# Altium schematic sheet CAN and Sensors.SchDoc
size A
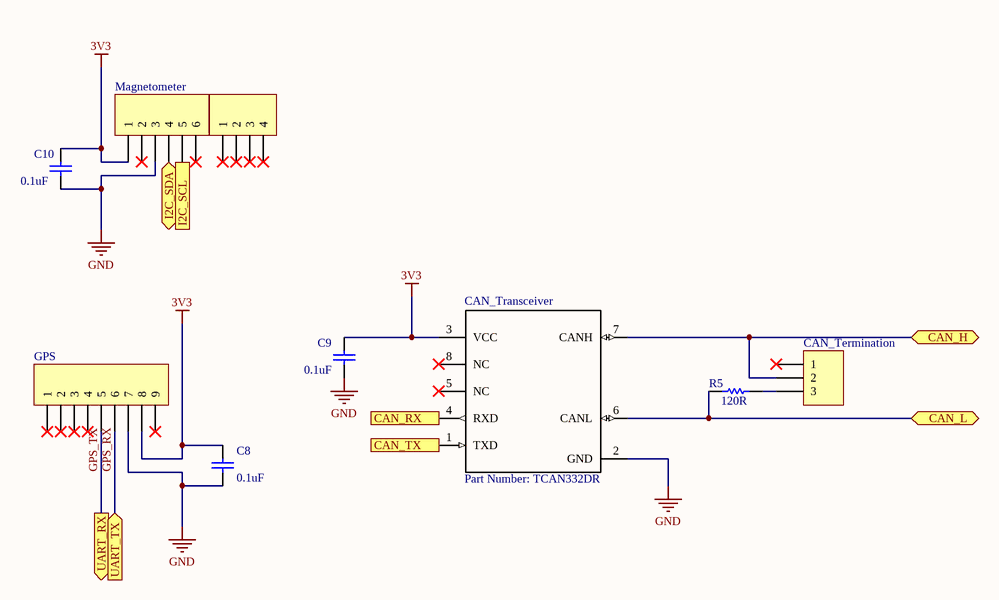
[diagram p0: CAN and Sensors.SchDoc]

## Parts
?  (no value)  [HDR1X4]
C8  0.1uF  [CAPC0805(2012)100_M]
C9  0.1uF  [CAPC0805(2012)100_M]
C10  0.1uF  [CAPC0805(2012)100_M]
CAN_Termination  (no value)  [HDR1X3]
CAN_Transceiver  Part Number: TCAN332DR  [D0008A_N]
GPS  (no value)  [HDR1X9]
Magnetometer  (no value)  [HDR1X6]
R5  120R  [RESC0805(2012)_N]

## Ports
CAN_H (bidir), CAN_L (bidir), CAN_RX (out), CAN_TX (in), I2C_SCL (in), I2C_SDA (bidir), UART_RX (out), UART_TX (in)

## Nets
3V3: C8.2 C9.2 C10.2 CAN_Transceiver.3(VCC) GPS.8 Magnetometer.1
GND: C8.1 C9.1 C10.1 CAN_Transceiver.2(GND) GPS.7 Magnetometer.3
CAN_H: CAN_Termination.2 CAN_Transceiver.7(CANH) ; port CAN_H
CAN_L: CAN_Transceiver.6(CANL) R5.1 ; port CAN_L
CAN_RX: CAN_Transceiver.4(RXD) ; port CAN_RX
CAN_TX: CAN_Transceiver.1(TXD) ; port CAN_TX
GPS_RX: GPS.6 ; port UART_TX
GPS_TX: GPS.5 ; port UART_RX
I2C_SCL: Magnetometer.5 ; port I2C_SCL
I2C_SDA: Magnetometer.4 ; port I2C_SDA
NetCAN_Termination_3: CAN_Termination.3 R5.2

Not connected (* = marked no-connect by the designer): ? 1* 2* 3* 4*; CAN_Termination 1*; CAN_Transceiver 5(NC)* 8(NC)*; GPS 1* 2* 3* 4* 9*; Magnetometer 2* 6*

## Library data of the parts
? = Header 4: Header, 4-Pin; LatestRevisionDate: 17-Jul-2002; LatestRevisionNote: Re-released for DXP Platform.; Publisher: Altium Limited
C8-C10 = CMP-1036-01451-1: CAP 33pF 200V ±1% 0805 (2012 Metric) Thickness 1mm SMD; Tolerance: Â±1%; Case-EIA: 0805; Case-Metric: 2012; Technology: SMT; Rated Voltage: 200 V; Max Thickness: 1 mm; Value: 33pF
CAN_Termination = Header 3: Header, 3-Pin; LatestRevisionDate: 17-Jul-2002; LatestRevisionNote: Re-released for DXP Platform.; Publisher: Altium Limited
CAN_Transceiver = TCAN332DR: No Description Available; Vendor: Texas Instruments; Built_By: Texas_Instrument_Team; Manufacturer_Part_Number: TCAN332DR; Copyright: Copyright (C) 2018 Accelerated Designs. All rights reserved; RefDes: RefDes; Type: DEV; Value: Value
GPS = Header 9: Header, 9-Pin; LatestRevisionDate: 17-Jul-2002; LatestRevisionNote: Re-released for DXP Platform.; Publisher: Altium Limited
Magnetometer = Header 6: Header, 6-Pin; LatestRevisionDate: 17-Jul-2002; LatestRevisionNote: Re-released for DXP Platform.; Publisher: Altium Limited
R5 = 120R 5% 0805: 120R 0.125W 5% 0805 (2012 Metric)  SMD; Case-Metric: 2012; Value: 120.00 Ohm; Case-EIA: 0805; Tolerance: 5 %; Technology: SMT; Power: 0.125 W